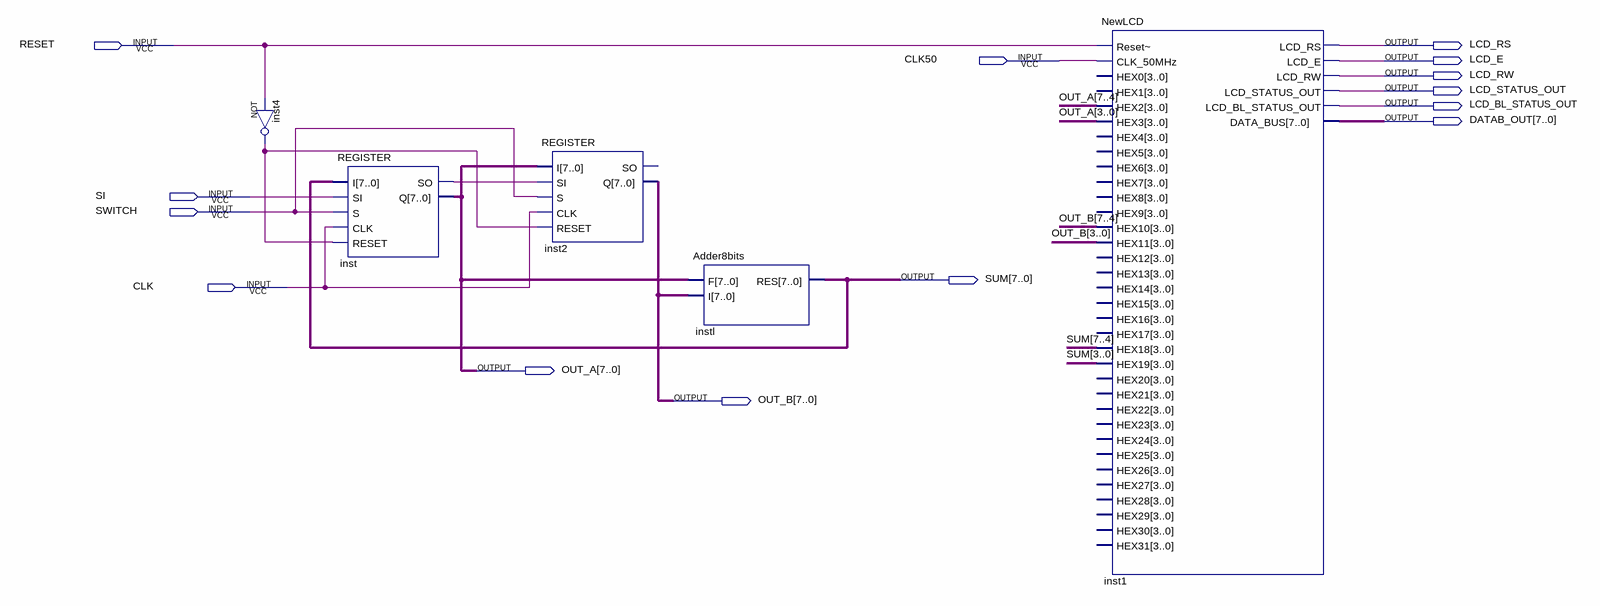
[diagram p0: schematic sheet]
// Quartus schematic FIBONACCI.bdf as structural Verilog: 5 symbols, 14 pins
module FIBONACCI (
  input  RESET,
  input  CLK50,
  input  SI,
  input  SWITCH,
  input  CLK,
  output LCD_RS,
  output LCD_E,
  output LCD_RW,
  output LCD_STATUS_OUT,
  output LCD_BL_STATUS_OUT,
  output [7:0] DATAB_OUT,
  output [7:0] SUM,
  output [7:0] OUT_A,
  output [7:0] OUT_B
);

  wire inst4_out, inst_so;

  not inst4 (inst4_out, RESET);
  REGISTER inst (.I(SUM), .SI(SI), .S(SWITCH), .CLK(CLK), .RESET(inst4_out), .SO(inst_so), .Q(OUT_A));
  REGISTER inst2 (.I(OUT_A), .SI(inst_so), .S(SWITCH), .CLK(CLK), .RESET(inst4_out), .Q(OUT_B));  // open: SO
  Adder8bits instl (.F(OUT_A), .I(OUT_B), .RES(SUM));
  NewLCD inst1 (
    .\Reset~ (RESET), .CLK_50MHz(CLK50), .HEX2(OUT_A[7:4]), .HEX3(OUT_A[3:0]), .HEX10(OUT_B[7:4]),
    .HEX11(OUT_B[3:0]), .HEX18(SUM[7:4]), .HEX19(SUM[3:0]), .LCD_RS(LCD_RS), .LCD_E(LCD_E), .LCD_RW(LCD_RW),
    .LCD_STATUS_OUT(LCD_STATUS_OUT), .LCD_BL_STATUS_OUT(LCD_BL_STATUS_OUT), .DATA_BUS(DATAB_OUT));  // open: HEX0, HEX1, HEX4, HEX5, HEX6, HEX7, HEX8, HEX9, HEX12, HEX13, HEX14, HEX15, HEX16, HEX17, HEX20, HEX21, HEX22, HEX23, HEX24, HEX25, HEX26, HEX27, HEX28, HEX29, HEX30, HEX31
endmodule
